# Altium schematic sheet USB.SchDoc
size B
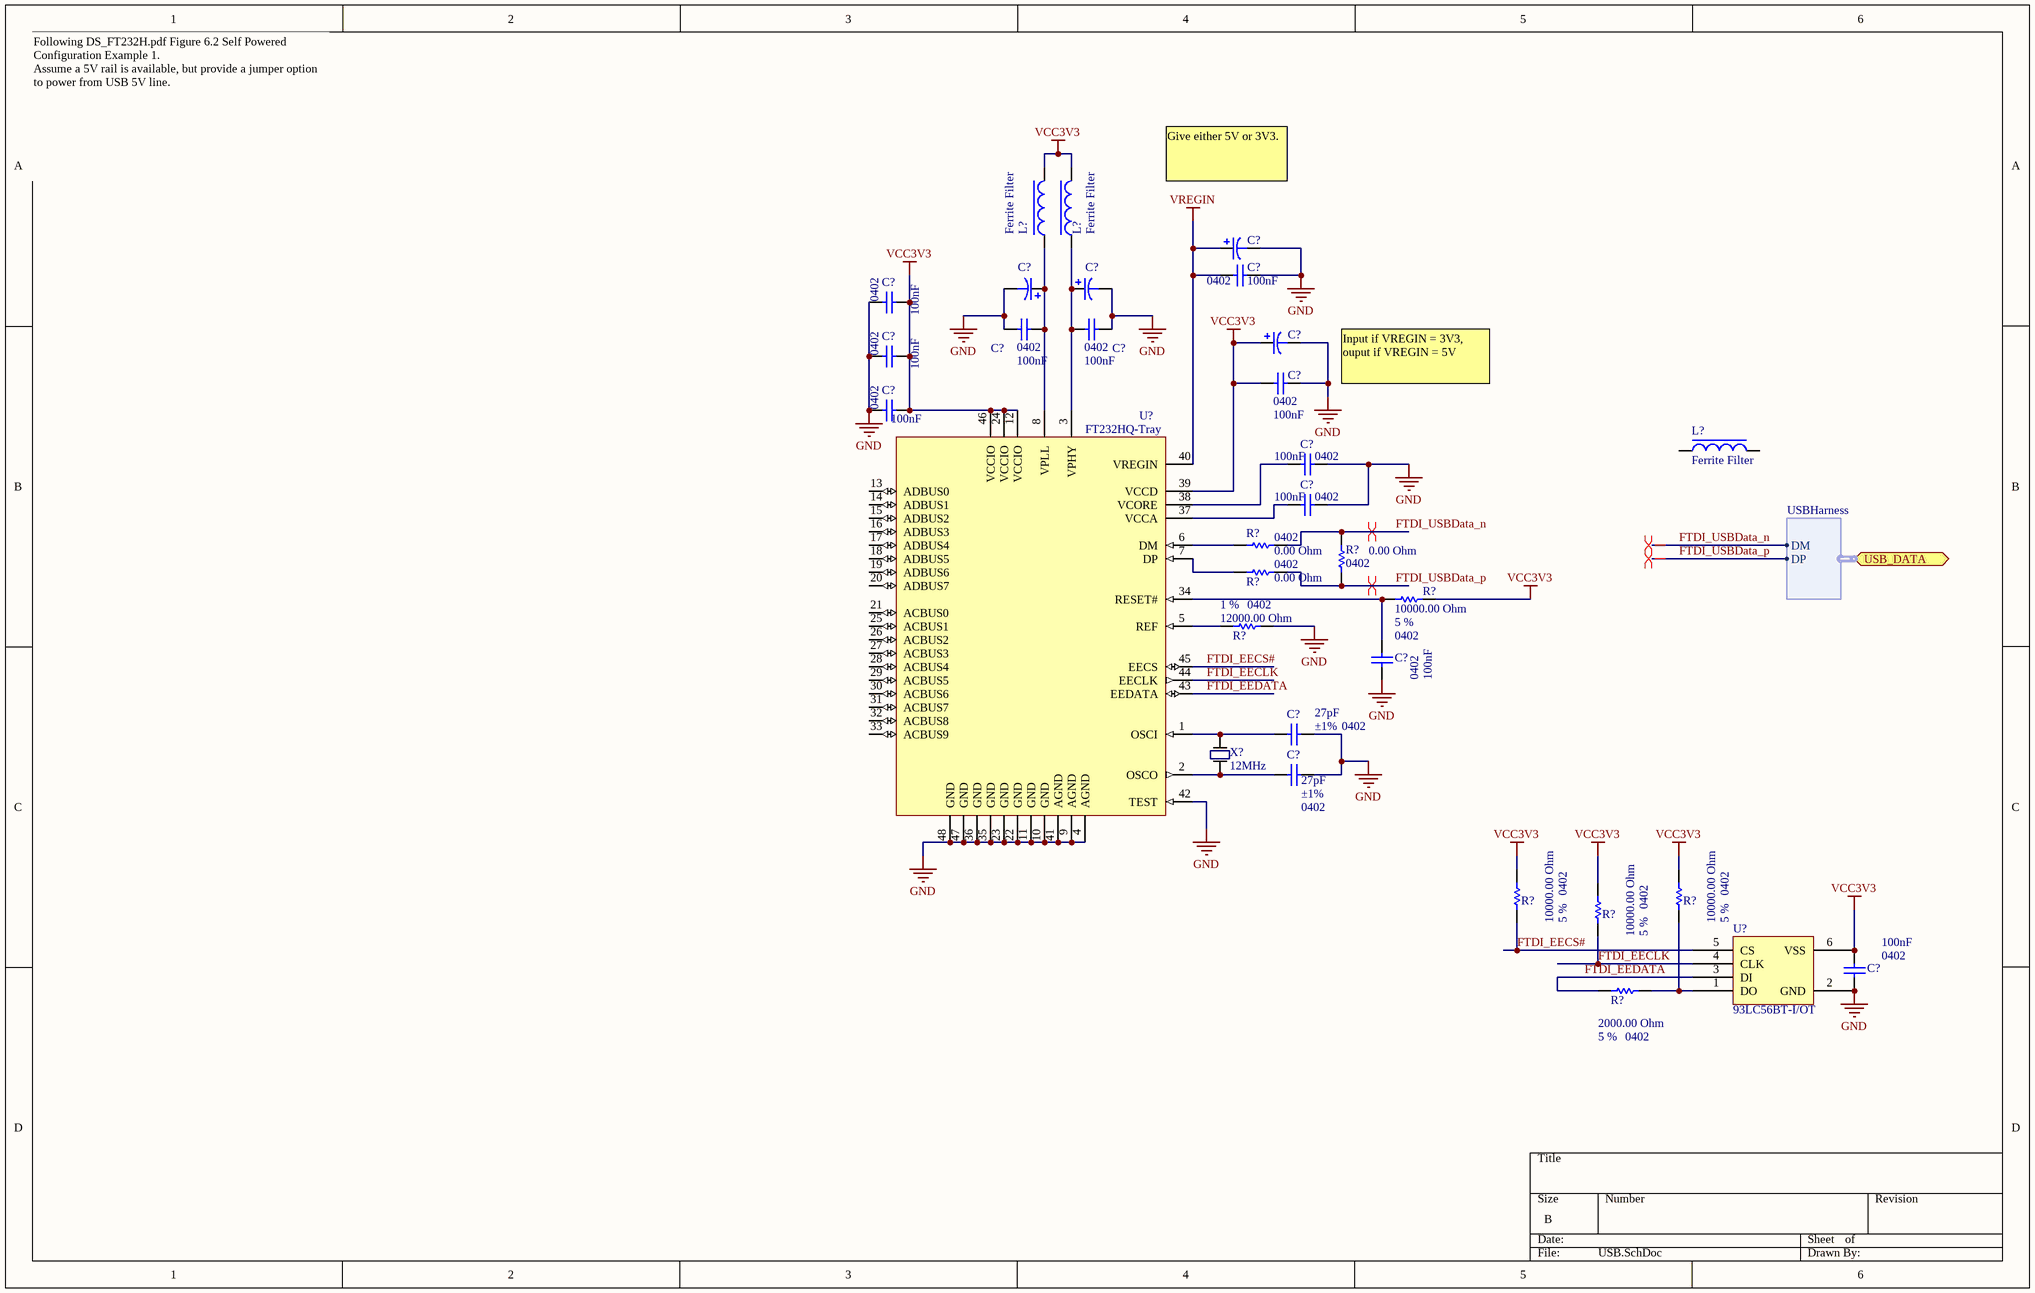
[diagram p0: USB.SchDoc]

## Parts
(Parts that share a designator on the sheet are numbered #1, #2 ... from top to bottom, then left to right.)
C?#1  Cap Pol  (value not drawn)
C?#2  value 100nF  Case-EIA: 0402  [CAPC0402(1005)60_M]  (hidden comment: CAP 100nF 10V 0402(1005))
C?#3  value 100nF  Case-EIA: 0402  [CAPC0402(1005)60_M]  (hidden comment: CAP 100nF 10V 0402(1005))
C?#4  Cap Pol  (value not drawn)
C?#5  Cap Pol  (value not drawn)
C?#6  value 100nF  Case-EIA: 0402  [CAPC0402(1005)60_M]  (hidden comment: CAP 100nF 10V 0402(1005))
C?#7  value 100nF  Case-EIA: 0402  [CAPC0402(1005)60_M]  (hidden comment: CAP 100nF 10V 0402(1005))
C?#8  value 100nF  Case-EIA: 0402  [CAPC0402(1005)60_M]  (hidden comment: CAP 100nF 10V 0402(1005))
C?#9  Cap Pol  (value not drawn)
C?#10  value 100nF  Case-EIA: 0402  [CAPC0402(1005)60_M]  (hidden comment: CAP 100nF 10V 0402(1005))
C?#11  value 100nF  Case-EIA: 0402  [CAPC0402(1005)60_M]  (hidden comment: CAP 100nF 10V 0402(1005))
C?#12  value 100nF  Case-EIA: 0402  [CAPC0402(1005)60_M]  (hidden comment: CAP 100nF 10V 0402(1005))
C?#13  value 100nF  Case-EIA: 0402  [CAPC0402(1005)60_M]  (hidden comment: CAP 100nF 10V 0402(1005))
C?#14  value 100nF  Case-EIA: 0402  [CAPC0402(1005)60_M]  (hidden comment: CAP 100nF 10V 0402(1005))
C?#15  value 27pF  Case-EIA: 0402  Tolerance: ±1%  [CAPC0402(1005)60_M]  (hidden comment: CAP 27pF 10V 0402(1005))
C?#16  value 27pF  Case-EIA: 0402  Tolerance: ±1%  [CAPC0402(1005)60_M]  (hidden comment: CAP 27pF 10V 0402(1005))
C?#17  value 100nF  Case-EIA: 0402  [CAPC0402(1005)60_M]  (hidden comment: CAP 100nF 10V 0402(1005))
L?#1  Ferrite Filter
L?#2  Ferrite Filter
L?#3  Ferrite Filter
R?#1  value 0.00 Ohm  Case-EIA: 0402  [RESC0402(1005)_N]  (hidden comment: Jumper 0402(1005))
R?#2  value 0.00 Ohm  Case-EIA: 0402  [RESC0402(1005)_N]  (hidden comment: Jumper 0402(1005))
R?#3  value 0.00 Ohm  Case-EIA: 0402  [RESC0402(1005)_N]  (hidden comment: Jumper 0402(1005))
R?#4  value 10000.00 Ohm  Tolerance: 5 %  Case-EIA: 0402  [RESC0402(1005)_N]  (hidden comment: 10K 5% 0402(1005))
R?#5  value 12000.00 Ohm  Tolerance: 1 %  Case-EIA: 0402  [RESC0402(1005)_N]  (hidden comment: 12K 1% 0402(1005))
R?#6  value 10000.00 Ohm  Tolerance: 5 %  Case-EIA: 0402  [RESC0402(1005)_N]  (hidden comment: 10K 5% 0402(1005))
R?#7  value 10000.00 Ohm  Tolerance: 5 %  Case-EIA: 0402  [RESC0402(1005)_N]  (hidden comment: 10K 5% 0402(1005))
R?#8  value 10000.00 Ohm  Tolerance: 5 %  Case-EIA: 0402  [RESC0402(1005)_N]  (hidden comment: 10K 5% 0402(1005))
R?#9  value 2000.00 Ohm  Case-EIA: 0402  Tolerance: 5 %  [RESC0402(1005)_N]  (hidden comment: 2K 5% 0402(1005))
U?#1  FT232HQ-Tray  [QFN48_N]
U?#2  93LC56BT-I/OT
X?  12MHz

## Ports
USB_DATA (harness USBHarness)

## Harnesses
USBHarness: DM, DP

## Nets
GND: C?#1.2 C?#2.1 C?#3.2 C?#4.2 C?#5.2 C?#6.1 C?#7.2 C?#8.1 C?#9.2 C?#10.1 C?#11.2 C?#12.1 C?#13.2 C?#14.1 C?#15.2 C?#16.1 C?#17.1 R?#5.1 U?#1.4(AGND) U?#1.9(AGND) U?#1.10(GND) U?#1.11(GND) U?#1.22(GND) U?#1.23(GND) U?#1.35(GND) U?#1.36(GND) U?#1.41(AGND) U?#1.42(TEST) U?#1.47(GND) U?#1.48(GND) U?#2.2(GND)
VCC3V3: C?#3.1 C?#7.1 C?#9.1 C?#10.2 C?#11.1 C?#17.2 L?#1.2 L?#2.2 R?#4.1 R?#6.2 R?#7.2 R?#8.2 U?#1.12(VCCIO) U?#1.24(VCCIO) U?#1.39(VCCD) U?#1.46(VCCIO) U?#2.6(VSS)
VREGIN: C?#1.1 C?#2.2 U?#1.40(VREGIN)
FTDI_EECLK: R?#8.1 U?#1.44(EECLK) U?#2.4(CLK)
FTDI_EECS#: R?#6.1 U?#1.45(EECS) U?#2.5(CS)
FTDI_EEDATA: R?#9.1 U?#1.43(EEDATA) U?#2.3(DI)
FTDI_USBData_n: R?#1.2 R?#3.2 ; port USB_DATA.DM
FTDI_USBData_p: R?#2.2 R?#3.1 ; port USB_DATA.DP
NetC?#4_1: C?#4.1 C?#8.2 L?#1.1 U?#1.8(VPLL)
NetC?#5_1: C?#5.1 C?#6.2 L?#2.1 U?#1.3(VPHY)
NetC?#12_2: C?#12.2 U?#1.38(VCORE)
NetC?#13_1: C?#13.1 U?#1.37(VCCA)
NetC?#14_2: C?#14.2 R?#4.2 U?#1.34(RESET#)
NetC?#15_1: C?#15.1 U?#1.1(OSCI) X?.2
NetC?#16_2: C?#16.2 U?#1.2(OSCO) X?.1
NetR?#1_1: R?#1.1 U?#1.6(DM)
NetR?#2_1: R?#2.1 U?#1.7(DP)
NetR?#5_2: R?#5.2 U?#1.5(REF)
NetR?#7_1: R?#7.1 R?#9.2 U?#2.1(DO)

Not connected (* = marked no-connect by the designer): L?#3 1 2; U?#1 13(ADBUS0) 14(ADBUS1) 15(ADBUS2) 16(ADBUS3) 17(ADBUS4) 18(ADBUS5) 19(ADBUS6) 20(ADBUS7) 21(ACBUS0) 25(ACBUS1) 26(ACBUS2) 27(ACBUS3) 28(ACBUS4) 29(ACBUS5) 30(ACBUS6) 31(ACBUS7) 32(ACBUS8) 33(ACBUS9)

## Layout directives
differential pair: FTDI_USBData_n, FTDI_USBData_p

## Notes on the sheet
- Following DS_FT232H.pdf Figure 6.2 Self Powered Configuration Example 1.
  Assume a 5V rail is available, but provide a jumper option to power from USB 5V line.
- Give either 5V or 3V3.
- Input if VREGIN = 3V3, ouput if VREGIN = 5V

## Library data of the parts
C?#1 C?#4 C?#5 C?#9 = Cap Pol: Polarized Cap
C?#2 C?#3 C?#6-C?#8 C?#10-C?#14 C?#17 = CMP-1034-02065-1: CAP 100nF 10V ±10% 0402 (1005 Metric) Thickness 0.6mm SMD; Case-Metric: 1005; Max Thickness: 0.6 mm; Tolerance: ±10%; Rated Voltage: 10 V; Technology: SMT
C?#15 C?#16 = CMP-1034-00944-1: CAP 27pF 10V ±1% 0402 (1005 Metric) Thickness 0.6mm SMD; Case-Metric: 1005; Rated Voltage: 10 V; Max Thickness: 0.6 mm; Technology: SMT
R?#1-R?#3 = CMP-1011-00001-1: Jumper 0402 (1005 Metric); Tolerance: None; Case-Metric: 1005; Power: None; Technology: SMT
R?#4 R?#6-R?#8 = CMP-1011-00098-1: 10K 0.063W 5% 0402 (1005 Metric)  SMD; Case-Metric: 1005; Technology: SMT; Power: 0.063 W
R?#5 = CMP-1011-00631-1: 12K 0.063W 1% 0402 (1005 Metric)  SMD; Case-Metric: 1005; Technology: SMT; Power: 0.063 W
R?#9 = CMP-1011-00081-1: 2K 0.063W 5% 0402 (1005 Metric)  SMD; Case-Metric: 1005; Power: 0.063 W; Technology: SMT
U?#1 = FT232HQ-Tray: Single Channel Hi-Speed USB to Multipurpose UART/FIFO IC, 48-pin QFN, Tray; Manufacturer: FTDI; DatasheetVersion: ver 1.8, Dec-2012; PackageVersion: Dec-12; PackageReference: QFN48; PackageDescription: 48-Pin Quad Flat No-Lead 0.5 mm Pitch, 6.2 x 6.2 mm Exposed Pad; PartNumber: FT232HQ-Tray; ComponentLink1Description: Manufacturer URL; ComponentLink1URL: http://www.ftdichip.com/; ComponentLink2Description: Datasheet; ComponentLink2URL: http://www.ftdichip.com/Support/Documents/DataSheets/ICs/DS_FT232H.pdf
U?#2 = 93LC56BT-I/OT: Microchip EEPROM
X? = Crystal: 12MHz Crystal